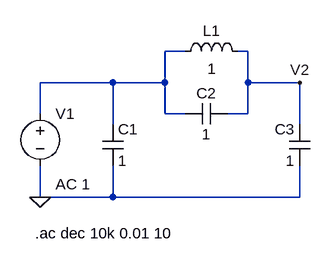
[diagram p0: schematic Punto3-B.asc]
Punto3-B.asc, the LTspice schematic file:
Version 4
SHEET 1 880 680
WIRE 192 16 160 16
WIRE 288 16 272 16
WIRE 80 64 -32 64
WIRE 160 64 160 16
WIRE 160 64 80 64
WIRE 288 64 288 16
WIRE 368 64 288 64
WIRE -32 112 -32 64
WIRE 160 112 160 64
WIRE 192 112 160 112
WIRE 288 112 288 64
WIRE 288 112 256 112
WIRE 80 128 80 64
WIRE 368 128 368 64
WIRE -32 240 -32 192
WIRE 80 240 80 192
WIRE 80 240 -32 240
WIRE 368 240 368 192
WIRE 368 240 80 240
FLAG -32 240 0
FLAG 368 64 V2
SYMBOL cap 64 128 R0
SYMATTR InstName C1
SYMATTR Value 1
SYMBOL cap 256 96 R90
WINDOW 0 0 32 VBottom 2
WINDOW 3 32 32 VTop 2
SYMATTR InstName C2
SYMATTR Value 1
SYMBOL cap 384 192 R180
WINDOW 0 24 56 Left 2
WINDOW 3 24 8 Left 2
SYMATTR InstName C3
SYMATTR Value 1
SYMBOL ind 176 32 R270
WINDOW 0 32 56 VTop 2
WINDOW 3 5 56 VBottom 2
SYMATTR InstName L1
SYMATTR Value 1
SYMBOL voltage -32 96 R0
WINDOW 123 24 124 Left 2
WINDOW 39 0 0 Left 0
SYMATTR InstName V1
SYMATTR Value ""
SYMATTR Value2 AC 1
TEXT -40 296 Left 2 !.ac dec 10k 0.01 10

The netlist it stands for:
* Punto3-B.asc
C1 N001 0 1
C2 V2 N001 1
C3 0 V2 1
L1 N001 V2 1
V1 N001 0 AC 1
.ac dec 10k 0.01 10
.backanno
.end

* Results of the author's LTspice run, read from the files saved beside the schematic
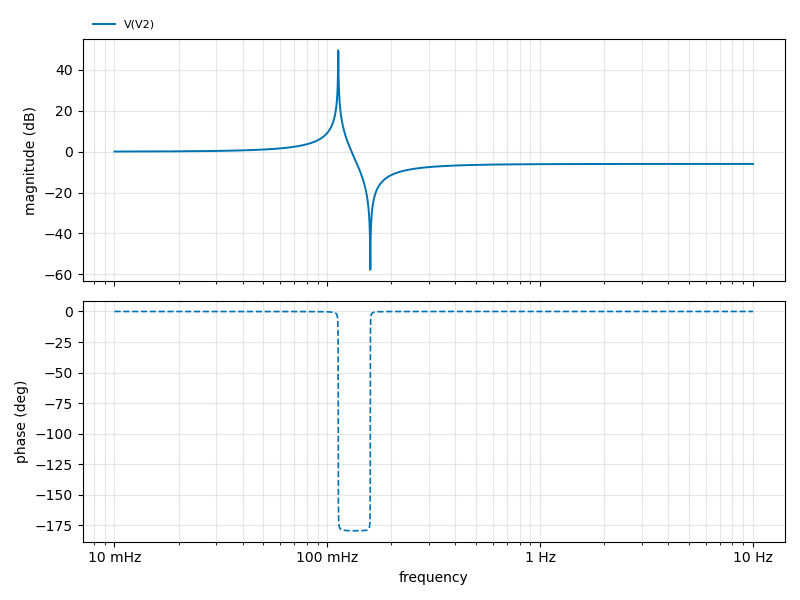
[diagram p1: AC Analysis of Punto3-B.asc, plotted from the saved traces]
* AC Analysis, 1 run:
*   V(V2): 0.03 dB at 10 mHz, -6.02 dB at 10 Hz, peak 50.97 dB at 112.5 mHz, 3 dB below the peak at 112.5 mHz and 112.6 mHz